# EAGLE design mfl_modul_u6052b (EAGLE 8.5.1)
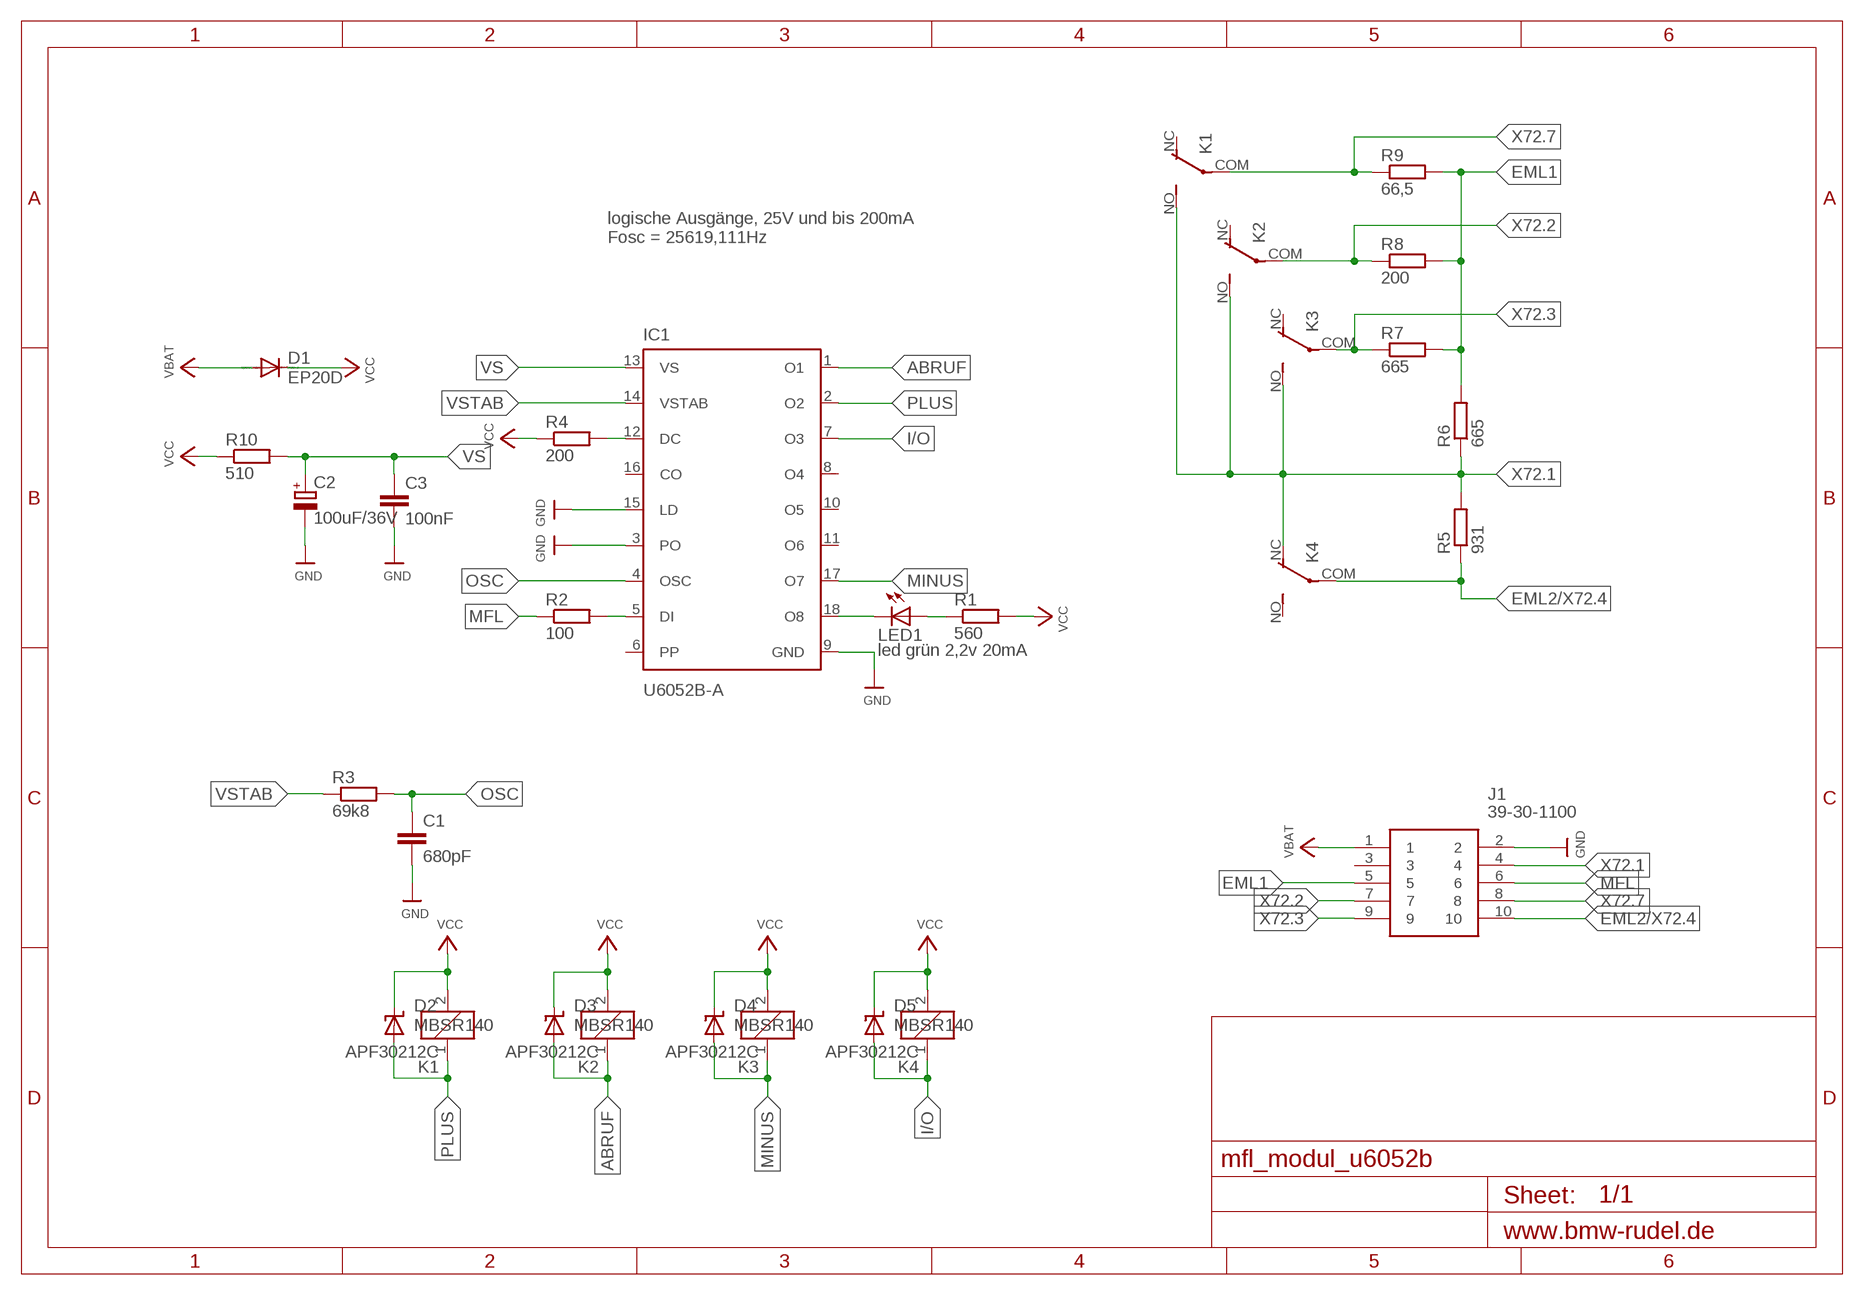
[diagram p0: schematic, sheet 1]

## Parts
C1  680pF  C-EU025-025X050  [C025-025X050]
C2  100uF/36V  CPOL-EUE2.5-6  [E2,5-6]
C3  100nF  C-EU025-025X050  [C025-025X050]
D1  EP20D  DIODE-DO15-12  [DO15-12]
D2  MBSR140  SHOTKY-SMDSMB  [DO214AA]
D3  MBSR140  SHOTKY-SMDSMB  [DO214AA]
D4  MBSR140  SHOTKY-SMDSMB  [DO214AA]
D5  MBSR140  SHOTKY-SMDSMB  [DO214AA]
IC1  U6052B-A  [DIL18]
J1  39-30-1100  [39-30-1100]
K1  APF30212C  [APF30212C]
K2  APF30212C  [APF30212C]
K3  APF30212C  [APF30212C]
K4  APF30212C  [APF30212C]
LED1  led grün 2,2v 20mA  LED3MM  [LED3MM]
R1  560  R-EU_0207/7  [0207/7]
R2  100  R-EU_0207/7  [0207/7]
R3  69k8  R-EU_0207/7  [0207/7]
R4  200  R-EU_0207/7  [0207/7]
R5  931  R-EU_0207/7  [0207/7]
R6  665  R-EU_0207/7  [0207/7]
R7  665  R-EU_0207/7  [0207/7]
R8  200  R-EU_0207/7  [0207/7]
R9  66,5  R-EU_0207/7  [0207/7]
R10  510  R-EU_0207/7  [0207/7]

## Nets
ABRUF: D3.A IC1.1(O1) K2.1
EML1: J1.5 R6.2 R7.2 R8.2 R9.2
EML2/X72.4: J1.10 K4.COM(2:P) R5.1
GND: C1.2 C2.- C3.2 IC1.3(PO) IC1.9(GND) IC1.15(LD) J1.2
I/O: D5.A IC1.7(O3) K4.1
MFL: J1.6 R2.1
MINUS: D4.A IC1.17(O7) K3.1
N$1: IC1.5(DI) R2.2
N$2: IC1.12(DC) R4.2
N$3: LED1.A R1.1
N$4: IC1.18(O8) LED1.K(C)
OSC: C1.1 IC1.4(OSC) R3.2
PLUS: D2.A IC1.2(O2) K1.1
VBAT: D1.A J1.1
VCC: D1.C D2.C D3.C D4.C D5.C K1.2 K2.2 K3.2 K4.2 R1.2 R4.1 R10.1
VS: C2.+ C3.1 IC1.13(VS) R10.2
VSTAB: IC1.14(VSTAB) R3.1
X72.1: J1.4 K1.NO(2:S) K2.NO(2:S) K3.NO(2:S) K4.NC(2:O) R5.2 R6.1
X72.2: J1.7 K2.COM(2:P) R8.1
X72.3: J1.9 K3.COM(2:P) R7.1
X72.7: J1.8 K1.COM(2:P) R9.1
Unconnected: IC1.6(PP) IC1.8(O4) IC1.10(O5) IC1.11(O6) IC1.16(CO) J1.3 K1.NC(2:O) K2.NC(2:O) K3.NC(2:O) K4.NO(2:S)

## Notes on the sheet
- logische Ausgänge, 25V und bis 200mA
  Fosc = 25619,111Hz

## Library data of the parts
C1 C3 = rcl:C-EU: CAPACITOR, European symbol; SPICEPREFIX: C
C2 = rcl:CPOL-EU: POLARIZED CAPACITOR, European symbol; SPICEPREFIX: C
D1 = diode:DIODE-: DIODE
D2-D5 = Heinrich:SHOTKY-SMD
IC1 = Heinrich:U6052B
J1 = Heinrich:39-30-1100: 10 way r/a PCB header w/peg,Mini-Fit Jr Molex MINI-FIT JR. Series, Series Number 5569, 4.2mm Pitch 10 Way 2 Row Shrouded Right Angle PCB Header, Through Hole Source: Datasheet <http://www.molex.com/webdocs/datasheets/pdf/en-us//0039301100_PCB_HEADERS.pdf>; ALLIED_NUMBER: 70190658; ALLIED_PRICE-STOCK: https://www.alliedelec.com/molex-incorporated-39-30-1100/70190658/; DESCRIPTION: 10 way r/a PCB header w/peg,Mini-Fit Jr Molex MINI-FIT JR. Series, Series Number 5569, 4.2mm Pitch 10 Way 2 Row Shrouded Right Angle PCB Header, Through Hole; HEIGHT: mm; MANUFACTURER_NAME: Molex; MANUFACTURER_PART_NUMBER: 39-30-1100; MOUSER_PART_NUMBER: 538-39-30-1100; MOUSER_PRICE-STOCK: https://www.mouser.com/Search/Refine.aspx?Keyword=538-39-30-1100; RS_PART_NUMBER: 5109871P; RS_PRICE-STOCK: http://uk.rs-online.com/web/p/products/5109871P
K1-K4 = relay:APF30212C: Compliant with European standards 1a/1c 6A Slim power relays Source: Data sheet <http://pewa.panasonic.com/assets/pcsd/catalog/pf-catalog.pdf>; OC_FARNELL: unknown
LED1 = led:LED: LED OSRAM: - CHIPLED LG R971, LG N971, LY N971, LG Q971, LY Q971, LO R971, LY R971 LH N974, LH R974 LS Q976, LO Q976, LY Q976 LO Q996 - Hyper CHIPLED LW Q18S LB Q993, LB Q99A, LB R99A - SideLED LS A670, LO A670, LY A670, LG A670, LP A670 LB A673, LV A673, LT A673, LW A673 LH A674 LY A675 LS A676, LA A676, LO A676, LY A676, LW A676 LS A679, LY A679, LG A679 - Hyper Micro SIDELED® LS Y876, LA Y876, LO Y876, LY Y876 LT Y87S - SmartLED LW L88C, LW L88S LB L89C, LB L89S, LG L890 LS L89K, LO L89K, LY L89K LS L896, LA L896, LO L896, LY L896 - TOPLED LS T670, LO T670, LY T670, LG T670, LP T670 LSG T670, LSP T670, LSY T670, LOP T670, LYG T670 LG T671, LOG T671, LSG T671 LB T673, LV T673, LT T673, LW T673 LH T674 LS T676, LA T676, LO T676, LY T676, LB T676, LH T676, LSB T676, LW T676 LB T67C, LV T67C, LT T67C, LS T67K, LO T67K, LY T67K, LW E67C LS E67B, LA E67B, LO E67B, LY E67B, LB E67C, LV E67C, LT E67C LW T67C LS T679, LY T679, LG T679 LS T770, LO T770, LY T770, LG T770, LP T770 LB T773, LV T773, LT T773, LW T773 LH T774 LS E675, LA E675, LY E675, LS T675 LS T776, LA T776, LO T776, LY T776, LB T776 LHGB T686 LT T68C, LB T68C - Hyper Mini TOPLED® LB M676 - Mini TOPLED Santana® LG M470 LS M47K, LO M47K, LY M47K Source: http://www.osram.convergy.de LUXEON: - LUMILED® LXK2-PW12-R00, LXK2-PW12-S00, LXK2-PW14-U00, LXK2-PW14-V00 LXK2-PM12-R00, LXK2-PM12-S00, LXK2-PM14-U00 LXK2-PE12-Q00, LXK2-PE12-R00, LXK2-PE12-S00, LXK2-PE14-T00, LXK2-PE14-U00 LXK2-PB12-K00, LXK2-PB12-L00, LXK2-PB12-M00, LXK2-PB14-N00, LXK2-PB14-P00, LXK2-PB14-Q00 LXK2-PR12-L00, LXK2-PR12-M00, LXK2-PR14-Q00, LXK2-PR14-R00 LXK2-PD12-Q00, LXK2-PD12-R00, LXK2-PD12-S00 LXK2-PH12-R00, LXK2-PH12-S00 LXK2-PL12-P00, LXK2-PL12-Q00, LXK2-PL12-R00 Source: www.luxeon.com KINGBRIGHT: KA-3528ASYC Source: www.kingbright.com
R1-R10 = rcl:R-EU_: RESISTOR, European symbol; SPICEPREFIX: R

## Board
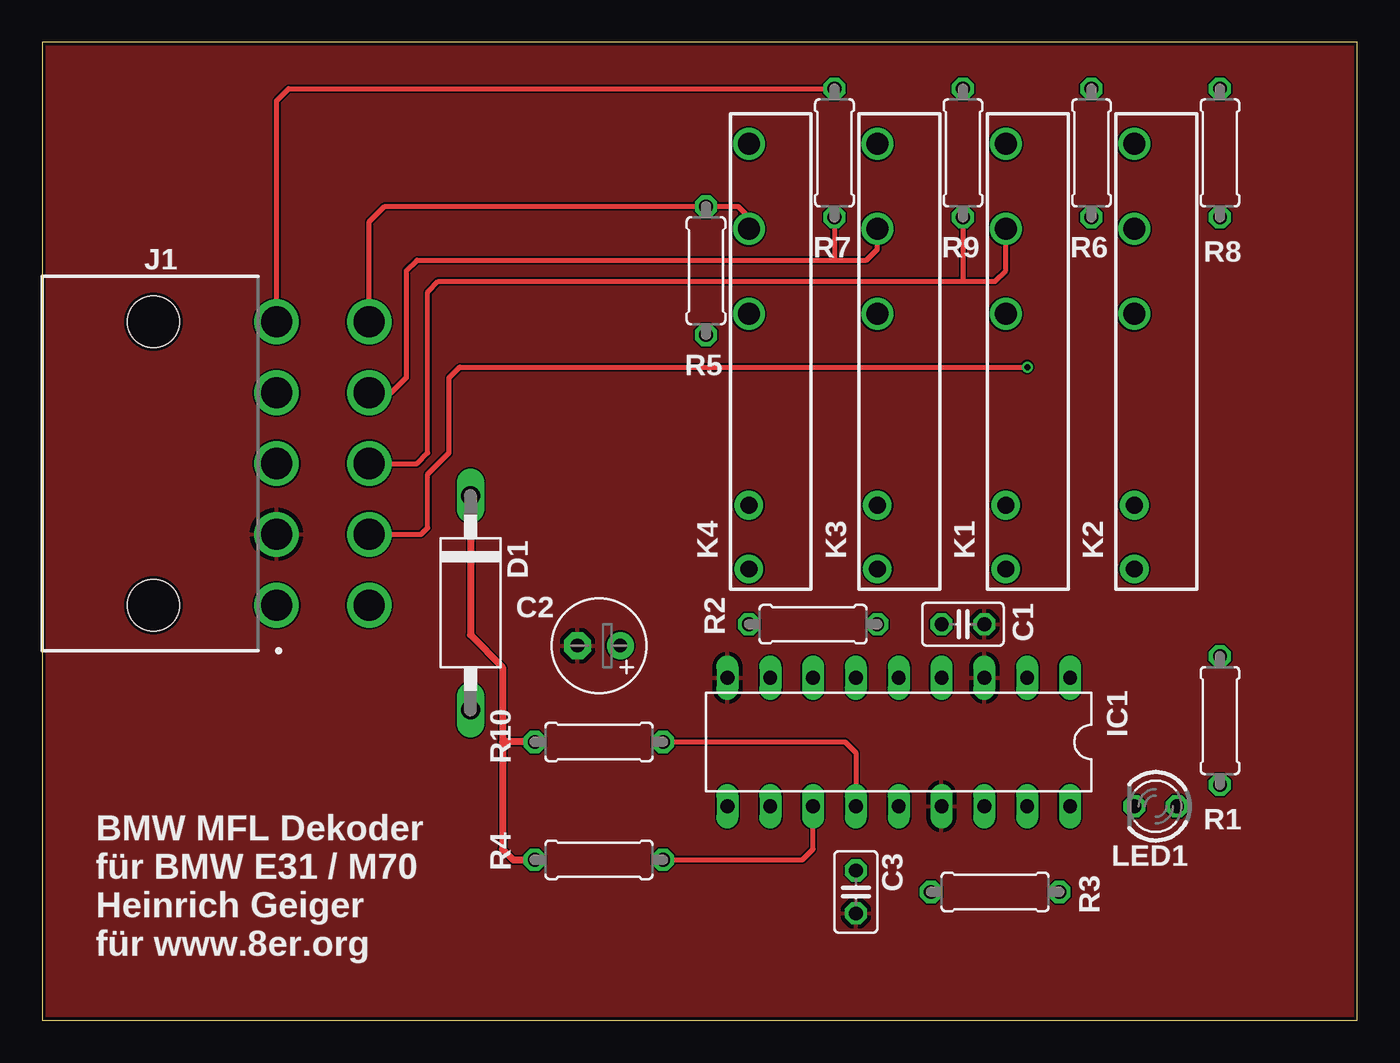
[diagram p1: board, top side]
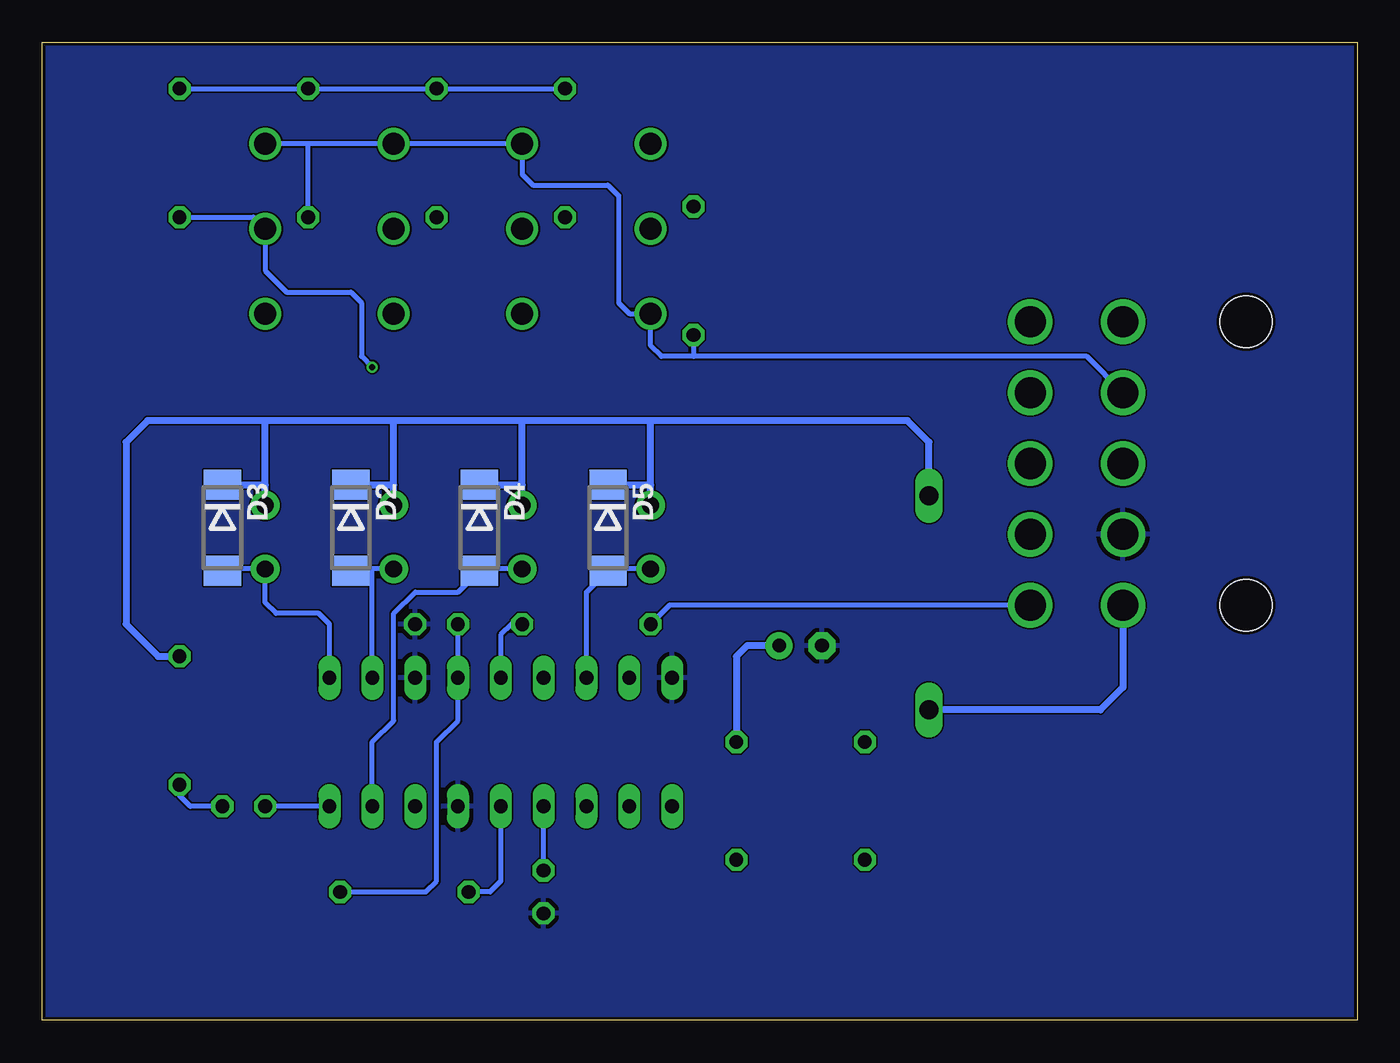
[diagram p2: board, bottom side, seen from below]

Size 78 x 58 mm. Coordinates in mm from the lower left corner, seen from the top.
Outline: 0,0 78,0 78,58 0,58 0,0
Copper layers (1*16): Top 0.035mm / dielectric 1.5mm / Bottom 0.035mm
Design rules "aisler_2_layer": minimum track width 0.1mm, minimum drill 0.2mm, track to track 0.1mm, track to pad 0.1mm, pad to pad 0.1mm, via to via 0.1mm, smd to smd 0.1mm, copper to edge 0.2mm, drill to drill 0.21mm, minimum pad ring 0.25mm, minimum via ring 0.15mm, stop-mask expansion 0mil, vias tented up to drill 0mil, thermal gap 10mil

### Footprints (pad centres in the part's own frame; a part is rotated, then mirrored left to right if it is on the bottom)
C025-025X050 = drill 0.813 octagon: 1 -1.27,0; 2 1.27,0
E2,5-6 = drill 0.813 pad 1.6: + -1.27,0 | drill 0.813 pad 1.6 octagon: - 1.27,0
DO15-12 = drill 1.118 long: A 6.35,0; C -6.35,0
DO214AA = smd 1.8 x 2.2: A 2.55,0; C -2.55,0
DIL18 = drill 0.813 long: 1 -10.16,-3.81; 2 -7.62,-3.81; 3 -5.08,-3.81; 4 -2.54,-3.81; 5 0,-3.81; 6 2.54,-3.81; 7 5.08,-3.81; 8 7.62,-3.81; 9 10.16,-3.81; 10 10.16,3.81; 11 7.62,3.81; 12 5.08,3.81; 13 2.54,3.81; 14 0,3.81; 15 -2.54,3.81; 16 -5.08,3.81; 17 -7.62,3.81; 18 -10.16,3.81
39-30-1100 = drill 1.85 pad 2.65: 1 8.4,13.9; 2 4.2,13.9; 3 0,13.9; 4 -4.2,13.9; 5 -8.4,13.9; 6 8.4,19.4; 7 4.2,19.4; 8 0,19.4; 9 -4.2,19.4; 10 -8.4,19.4 | hole 3.05: -8.4,6.6; 8.4,6.6
APF30212C = drill 1 pad 1.7: 1 -12.6,0; 2 -8.82,0 | drill 1.3 pad 1.9: COM 7.56,0; NC 2.52,0; NO 12.6,0
LED3MM = drill 0.813 octagon: A -1.27,0; K 1.27,0
0207/7 = drill 0.813 octagon: 1 -3.81,0; 2 3.81,0

### Placement (x,y rotation side)
C1  54.61,23.5 0 top
C2  33.02,22.23 180 top
C3  48.26,7.62 270 top
D1  25.4,24.77 270 top
D2  59.69,29.21 270 bottom
D3  67.31,29.21 270 bottom
D4  52.07,29.21 270 bottom
D5  44.45,29.21 270 bottom
IC1  50.8,16.51 180 top
J1  0,33.02 270 top
K1  57.15,39.37 90 top
K2  64.77,39.37 90 top
K3  49.53,39.37 90 top
K4  41.91,39.37 90 top
LED1  66.04,12.7 180 top
R1  69.85,17.78 90 top
R2  45.72,23.5 0 top
R3  69k6  [0207/7]  56.52,7.62 0 top
R4  33.02,9.53 0 top
R5  39.37,44.45 270 top
R6  62.23,51.44 90 top
R7  46.99,51.44 90 top
R8  69.85,51.44 90 top
R9  54.61,51.44 90 top
R10  33.02,16.51 0 top

### Tracks (layer width: path | path; a pad name or v marks a point on that pad's centre or on a via)
ABRUF
  Bottom 0.305: IC1.1 60.96,23.5 61.59,24.13 64.14,24.13 64.77,24.77 K2.1 67.2,26.77 D3.A
EML1
  Top 0.305: J1.5 13.9,54.54 14.61,55.24 R7.2
  Bottom 0.305: R8.2 R6.2 R9.2 R7.2
EML2/X72.4
  Top 0.305: K4.COM 41.91,47.62 41.27,48.26 R5.1 20.32,48.26 19.4,47.34 J1.10
GND
  pour Top: 0,57.78 78.11,57.78 78.11,0 0,0
  pour Bottom: 0,58.42 78.74,58.42 78.74,0 0,0
I/O
  Bottom 0.305: IC1.7 45.72,25.39 D5.A 44.34,26.77 K4.1
MFL
  Bottom 0.305: J1.6 40.78,24.62 R2.1
MINUS
  Bottom 0.305: K3.1 51.96,26.77 D4.A 53.33,25.4 55.88,25.4 57.15,24.13 57.15,17.78 58.42,16.51 IC1.17
N$1
  Bottom 0.305: R2.2 50.16,23.5 50.8,22.86 IC1.5
N$2
  Top 0.305: IC1.12 45.72,10.16 45.09,9.53 R4.2
N$3
  Bottom 0.305: LED1.A 69.22,12.7 69.85,13.34 R1.1
N$4
  Bottom 0.305: IC1.18 LED1.K
OSC
  Bottom 0.305: R3.2 55.24,7.62 54.61,8.26 54.61,16.51 53.34,17.78 IC1.4 C1.1
PLUS
  Bottom 0.305: K1.1 58.42,26.77 | 58.42,26.77 59.58,26.77 D2.A | IC1.2 58.42,26.77
VBAT
  Bottom 0.406: J1.1 13.9,19.75 15.24,18.41 D1.A
VCC
  Top 0.406: D1.C 25.4,22.86 27.3,20.95 27.3,16.51 | R10.1 27.3,16.51 | R4.1 27.94,9.53 27.3,10.16 27.3,16.51
  Bottom 0.406: D1.C 25.4,34.29 26.67,35.56 41.91,35.56 | 41.91,35.56 49.53,35.56 | 49.53,35.56 57.15,35.56 | 57.15,35.56 64.77,35.56 | 64.77,35.56 71.75,35.56 73.03,34.29 73.03,23.5 71.12,21.59 R1.2 | K4.2 41.91,31.75 | 41.91,31.75 41.91,35.56 | K3.2 49.53,31.75 | 49.53,31.75 49.53,35.56 | K1.2 57.15,31.75 | 57.15,31.75 57.15,35.56 | K2.2 64.77,31.75 | 64.77,31.75 64.77,35.56 | D5.C 41.92,31.76 41.91,31.75 | D4.C 49.54,31.76 49.53,31.75 | D2.C 57.16,31.76 57.15,31.75 | D3.C 64.78,31.76 64.77,31.75
VS
  Top 0.305: IC1.13 48.26,15.88 47.62,16.51 R10.2
  Bottom 0.305: C3.1 IC1.13
  Bottom 0.406: C2.+ 36.2,22.23 36.83,21.59 R10.2
VSTAB
  Bottom 0.305: IC1.14 50.8,8.26 51.44,7.62 R3.1
X72.1
  Bottom 0.305: K4.NC 41.91,40.01 41.27,39.37 39.37,39.37 | K4.NC 41.89,41.91 | K4.NC 43.17,41.9 43.81,42.55 43.81,48.9 44.45,49.53 48.9,49.53 49.53,50.16 K3.NO K1.NO 62.23,51.97 | 62.23,51.97 K2.NO | R6.1 62.23,51.97 | J1.4 16.05,39.37 39.37,39.37 | R5.2 39.37,39.37
X72.2  (via drill 0.35)
  Top 0.305: J1.7 22.47,28.82 22.86,29.21 22.86,32.38 24.13,33.66 24.13,38.1 24.77,38.73 v58.42,38.73
  Bottom 0.305: R8.1 65.47,47.62 K2.COM 64.77,44.45 63.5,43.18 59.69,43.18 59.05,42.55 59.05,39.37 v58.42,38.73
X72.3
  Top 0.305: J1.9 20.71,37.22 21.59,38.1 21.59,44.45 22.23,45.09 46.99,45.09 | K3.COM 49.53,45.72 48.9,45.09 46.99,45.09 | R7.1 46.99,45.09
X72.7
  Top 0.305: 54.61,43.81 23.5,43.81 22.86,43.18 22.86,33.66 22.23,33.02 J1.8 | 54.61,43.81 56.52,43.81 57.15,44.45 K1.COM | R9.1 54.61,43.81

### Text on the board
tNames: BMW MFL Dekoder / für BMW E31 / M70 / Heinrich Geiger / für www.8er.org